# Altium project Arduino_StepperPrototype.PrjPcb
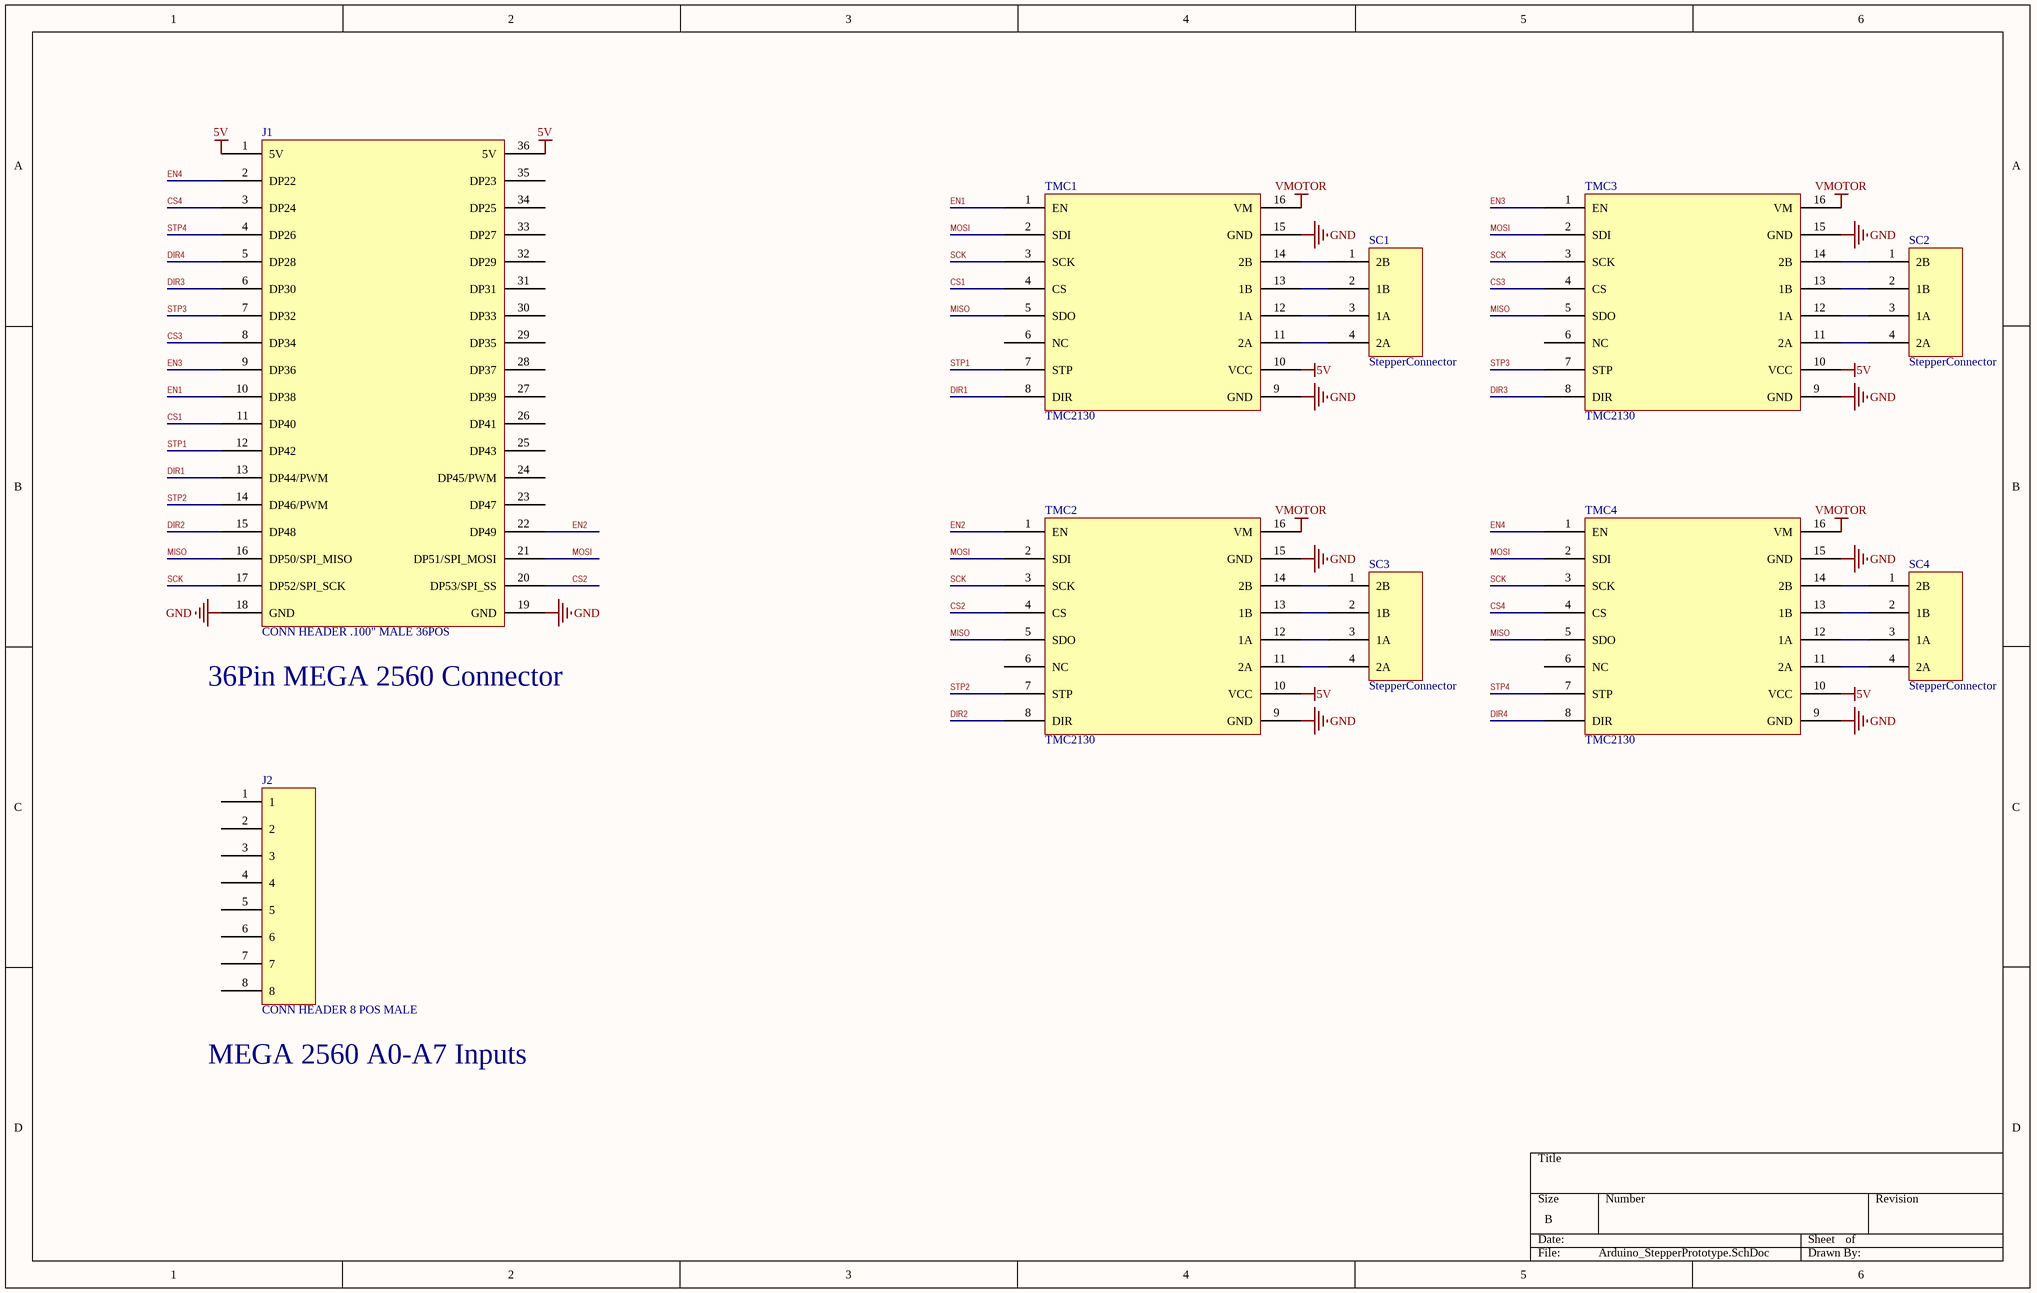
[diagram p0: Arduino_StepperPrototype.SchDoc]
1 sheet, 10 parts. Net scope: global (net labels, ports and power ports of the same name join across sheets).
Board file: Arduino_StepperPrototype.PcbDoc

## Sheet Arduino_StepperPrototype.SchDoc
size B

### Parts
J1  CONN HEADER .100" MALE 36POS  [DIP36_MALE]
J2  CONN HEADER 8 POS MALE  [DIP8_MALE]
SC1  StepperConnector  [DIP4]
SC2  StepperConnector  [DIP4]
SC3  StepperConnector  [DIP4]
SC4  StepperConnector  [DIP4]
TMC1  TMC2130  [DIP16_Stepper]
TMC2  TMC2130  [DIP16_Stepper]
TMC3  TMC2130  [DIP16_Stepper]
TMC4  TMC2130  [DIP16_Stepper]

### Nets
5V: J1.1(5V) J1.36(5V) TMC1.10(VCC) TMC2.10(VCC) TMC3.10(VCC) TMC4.10(VCC)
GND: J1.18(GND) J1.19(GND) TMC1.9(GND) TMC1.15(GND) TMC2.9(GND) TMC2.15(GND) TMC3.9(GND) TMC3.15(GND) TMC4.9(GND) TMC4.15(GND)
VMOTOR: TMC1.16(VM) TMC2.16(VM) TMC3.16(VM) TMC4.16(VM)
CS1: J1.11(DP40) TMC1.4(CS)
CS2: J1.20(DP53/SPI_SS) TMC2.4(CS)
CS3: J1.8(DP34) TMC3.4(CS)
CS4: J1.3(DP24) TMC4.4(CS)
DIR1: J1.13(DP44/PWM) TMC1.8(DIR)
DIR2: J1.15(DP48) TMC2.8(DIR)
DIR3: J1.6(DP30) TMC3.8(DIR)
DIR4: J1.5(DP28) TMC4.8(DIR)
EN1: J1.10(DP38) TMC1.1(EN)
EN2: J1.22(DP49) TMC2.1(EN)
EN3: J1.9(DP36) TMC3.1(EN)
EN4: J1.2(DP22) TMC4.1(EN)
MISO: J1.16(DP50/SPI_MISO) TMC1.5(SDO) TMC2.5(SDO) TMC3.5(SDO) TMC4.5(SDO)
MOSI: J1.21(DP51/SPI_MOSI) TMC1.2(SDI) TMC2.2(SDI) TMC3.2(SDI) TMC4.2(SDI)
SCK: J1.17(DP52/SPI_SCK) TMC1.3(SCK) TMC2.3(SCK) TMC3.3(SCK) TMC4.3(SCK)
STP1: J1.12(DP42) TMC1.7(STP)
STP2: J1.14(DP46/PWM) TMC2.7(STP)
STP3: J1.7(DP32) TMC3.7(STP)
STP4: J1.4(DP26) TMC4.7(STP)
NetSC1_1: SC1.1(2B) TMC1.14(2B)
NetSC1_2: SC1.2(1B) TMC1.13(1B)
NetSC1_3: SC1.3(1A) TMC1.12(1A)
NetSC1_4: SC1.4(2A) TMC1.11(2A)
NetSC2_1: SC2.1(2B) TMC3.14(2B)
NetSC2_2: SC2.2(1B) TMC3.13(1B)
NetSC2_3: SC2.3(1A) TMC3.12(1A)
NetSC2_4: SC2.4(2A) TMC3.11(2A)
NetSC3_1: SC3.1(2B) TMC2.14(2B)
NetSC3_2: SC3.2(1B) TMC2.13(1B)
NetSC3_3: SC3.3(1A) TMC2.12(1A)
NetSC3_4: SC3.4(2A) TMC2.11(2A)
NetSC4_1: SC4.1(2B) TMC4.14(2B)
NetSC4_2: SC4.2(1B) TMC4.13(1B)
NetSC4_3: SC4.3(1A) TMC4.12(1A)
NetSC4_4: SC4.4(2A) TMC4.11(2A)

Not connected (* = marked no-connect by the designer): J1 23(DP47) 24(DP45/PWM) 25(DP43) 26(DP41) 27(DP39) 28(DP37) 29(DP35) 30(DP33) 31(DP31) 32(DP29) 33(DP27) 34(DP25) 35(DP23); J2 1 2 3 4 5 6 7 8; TMC1 6(NC); TMC2 6(NC); TMC3 6(NC); TMC4 6(NC)

### Notes on the sheet
- (near J1) 36Pin MEGA 2560 Connector
- (near J2) MEGA 2560 A0-A7 Inputs

### Library data of the parts
J1 = PREC018DAAN-RC: CONN HEADER .100" DUAL STR 36POS; Manufacturer: Sullins; Connector Type: Header, Unshrouded, Breakaway; Number of Positions: 36; Number of Positions Loaded: All; Pitch: 0.100" (2.54mm); Online Catalog: 0.100" (2.54mm) Pitch Connector Headers; Other Names: S9500E-18  S9500E-18-ND; Supplier 1: Digi-Key; Manufacturer Part Number: PREC018DAAN-RC; Stock 1: 154; Pricing 1: 1=0.69, 10=0.643, 25=0.5788, 50=0.5146, 100=0.4931, 250=0.4502, 500=0.4288 (USD); Standard Package: 1; Category: Connectors, Interconnects; Family: Rectangular Connectors - Headers, Male Pins; Series: -; Packaging: Bulk; Contact Type: Male Pin; Number of Rows: 2; Row Spacing: 0.100" (2.54mm); Contact Mating Length: 0.230" (5.84mm); Mounting Type: Through Hole; Termination: Solder; Fastening Type: -; Features: -; Contact Finish: Tin; Contact Finish Thickness: -; Color: Black; ComponentLink1URL: https://drawings-pdf.s3.amazonaws.com/11636.pdf?src-supplier=Digi-Key; ComponentLink1Description: https://drawings-pdf.s3.amazonaws.com/11636.pdf?src-supplier=Digi-Key; Supplier Part Number 1: S2012EC-18-ND
J2 = PREC008SAAN-RC: Manufacturer: Sullins; Connector Type: Header, Unshrouded, Breakaway; Number of Positions: 8; Number of Positions Loaded: All; Pitch: 0.100" (2.54mm); Online Catalog: 0.100" (2.54mm) Pitch Connector Headers; Other Names: S9499E-08  S9499E-08-ND; Supplier 1: Digi-Key; Manufacturer Part Number: PREC008SAAN-RC; Stock 1: 3273; Pricing 1: 1=0.19, 10=0.178, 25=0.152, 50=0.133, 100=0.1236, 250=0.1093, 500=0.1045 (USD); Standard Package: 1; Category: Connectors, Interconnects; Family: Rectangular Connectors - Headers, Male Pins; Series: -; Packaging: Bulk; Contact Type: Male Pin; Number of Rows: 1; Row Spacing: -; Contact Mating Length: 0.230" (5.84mm); Mounting Type: Through Hole; Termination: Solder; Fastening Type: -; Features: -; Contact Finish: Tin; Contact Finish Thickness: -; Color: Black; ComponentLink1URL: https://media.digikey.com/PDF/Data%20Sheets/Sullins%20PDFs/z%20RzCzzzSzzN-RC,%20ST,11635-B.pdf?src-supplier=Digi-Key; ComponentLink1Description: https://media.digikey.com/PDF/Data%20Sheets/Sullins%20PDFs/z%20RzCzzzSzzN-RC,%20ST,11635-B.pdf?src-supplier=Digi-Key; Supplier Part Number 1: S1012EC-08-ND
SC1-SC4 = StepperConn
TMC1-TMC4 = SilentStepStick_BigTreeTech_TMC2130V1.1: Knockoff SilentStepStick